# Altium schematic sheet Sheet2.SchDoc
size B; DrawnBy: Mike Jarabek
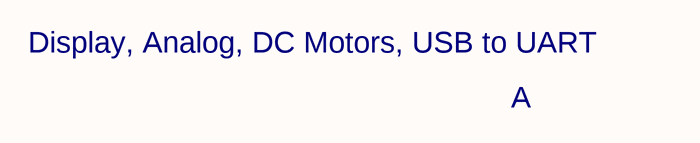
[diagram p0: Sheet2.SchDoc]

## Notes on the sheet
- Display, Analog, DC Motors, USB to UART
- A